# EAGLE design Pi0cket (EAGLE 7.7.0)
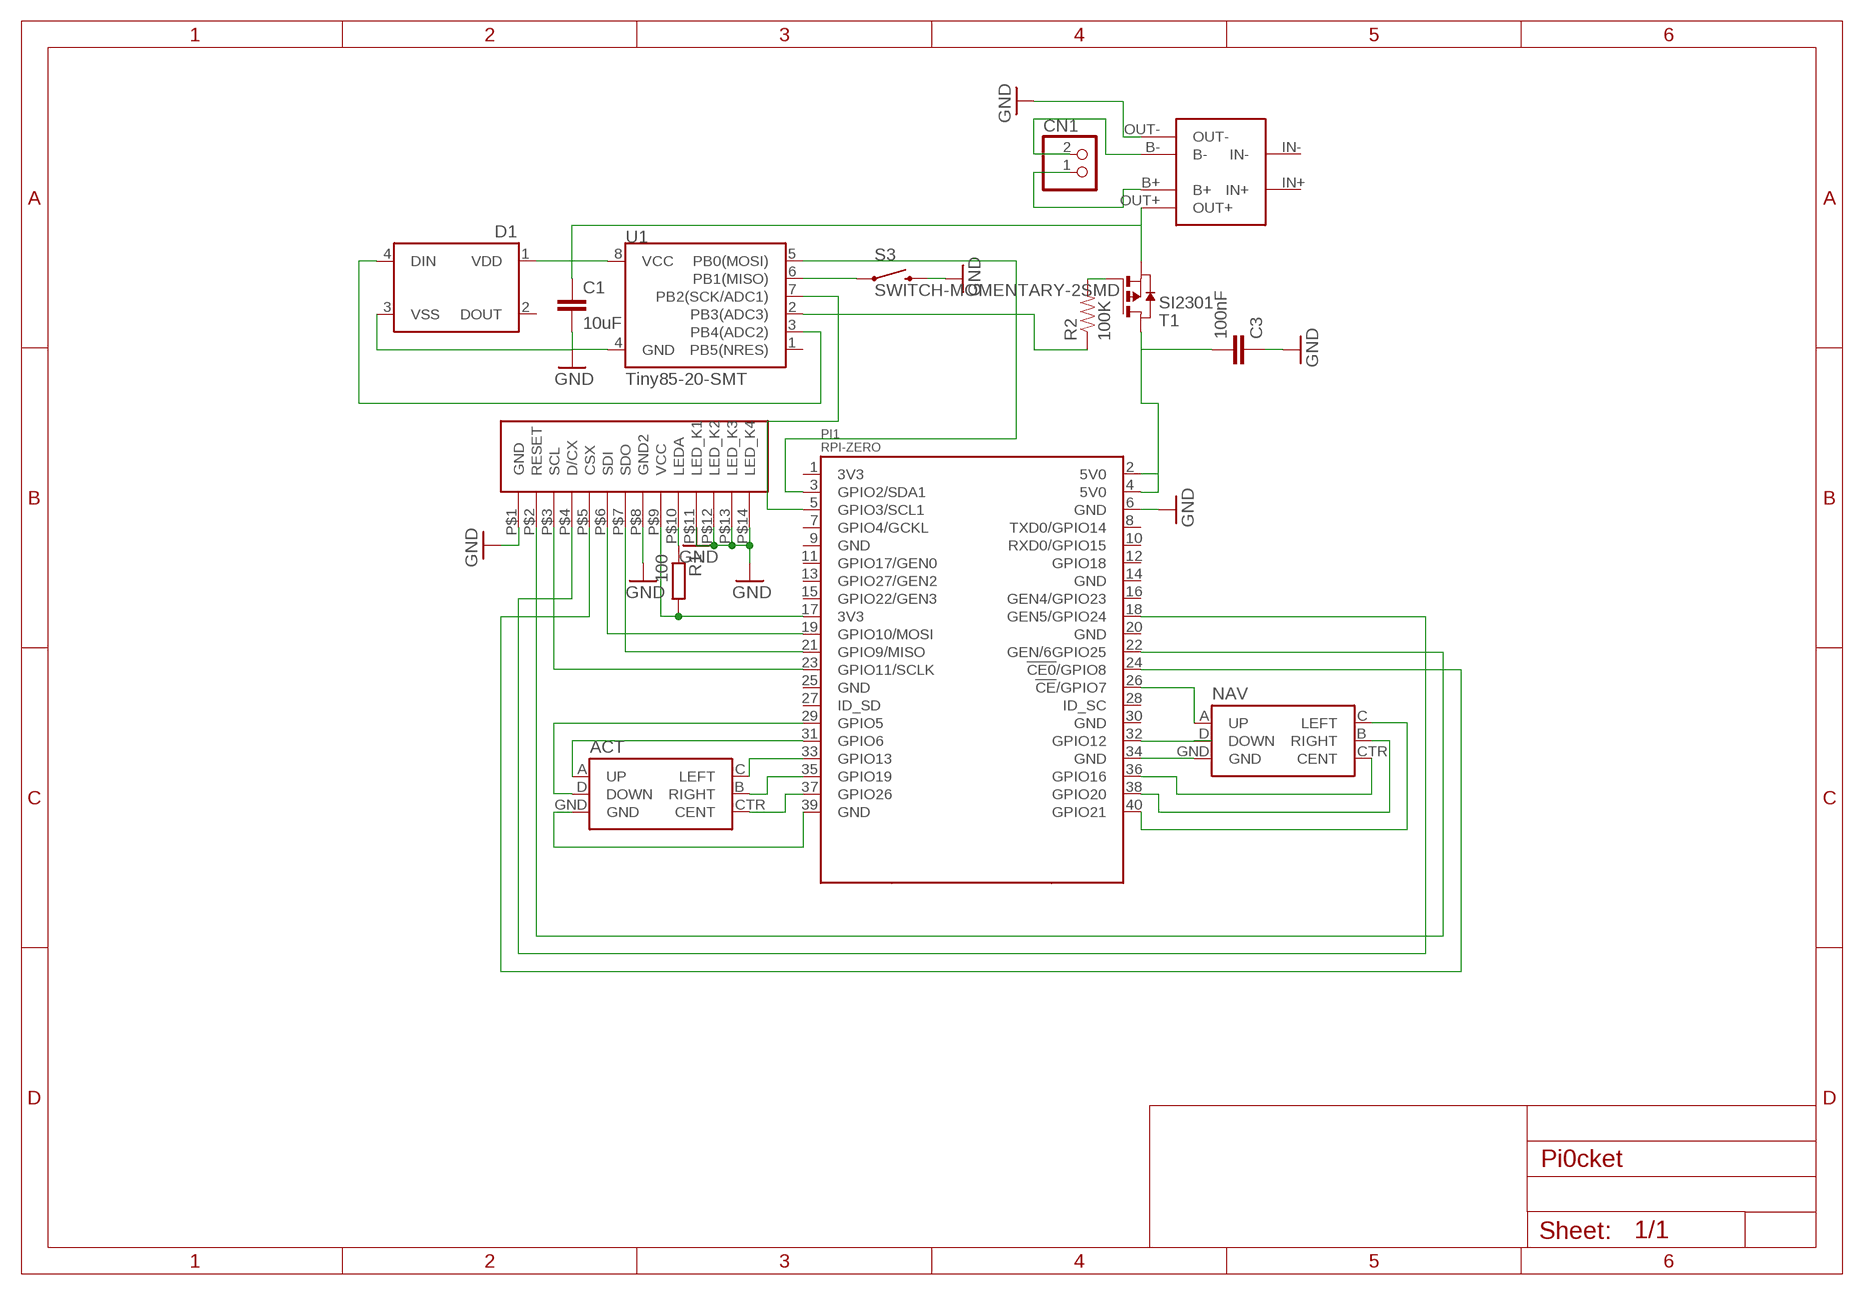
[diagram p0: schematic, sheet 1]

## Parts
ACT  JOYSTICK_MINI  [JOYSTICK_MINI]
C1  10uF  C-EUC0603K  [C0603K]
C3  100nF  C-EUC0603K  [C0603K]
CN1  JST_2PIN-SMT-RA  [JST-PH-2-SMT-RA]
D1  WS2812B  [WS2812B]
NAV  JOYSTICK_MINI  [JOYSTICK_MINI]
PI1  RPI-ZERO  [RASPBERRYPI_BASTELSTUBE_V13_RASPI_BOARD_B+_FULL]
POWER1  03962A  [03962A]
R1  100  R-EU_R0805  [R0805]
R2  100K  RESISTOR0603-RES  [0603-RES]
S3  SWITCH-MOMENTARY-2SMD  [TACTILE-SWITCH-SMD]
SCREEN1  ILI9341-2.2  [ILI9341-2.2]
T1  SI2301  PMOSSOT23  [SOT-23]
U1  Tiny85-20-SMT  ATTINY45TINY85-20-SMT  [SO08-EIAJ]

## Nets
5V0@2: C3.2 PI1.2(5V0) PI1.4(5V0) T1.1(D)
GND: C1.2 C3.1 D1.3(VSS) PI1.6(GND) POWER1.OUT- S3.3 SCREEN1.P$1(GND) SCREEN1.P$8(GND2) SCREEN1.P$11(LED_K1) SCREEN1.P$12(LED_K2) SCREEN1.P$13(LED_K3) SCREEN1.P$14(LED_K4) U1.4(GND)
GND@3: ACT.GND PI1.39(GND)
GND@7: NAV.GND PI1.34(GND)
N$1: PI1.22(GEN/6GPIO25) SCREEN1.P$2(RESET)
N$2: PI1.23(GPIO11/SCLK) SCREEN1.P$3(SCL)
N$3: PI1.19(GPIO10/MOSI) SCREEN1.P$6(SDI)
N$4: PI1.21(GPIO9/MISO) SCREEN1.P$7(SDO)
N$5: R1.1 SCREEN1.P$10(LEDA)
N$6: PI1.18(GEN5/GPIO24) SCREEN1.P$4(D/CX)
N$7: PI1.24(!CE0!/GPIO8) SCREEN1.P$5(CSX)
N$8: NAV.CTR(CENT) PI1.36(GPIO16)
N$9: ACT.CTR(CENT) PI1.37(GPIO26)
N$10: ACT.B(RIGHT) PI1.35(GPIO19)
N$11: ACT.C(LEFT) PI1.33(GPIO13)
N$12: ACT.A(UP) PI1.31(GPIO6)
N$13: ACT.D(DOWN) PI1.29(GPIO5)
N$14: NAV.B(RIGHT) PI1.38(GPIO20)
N$15: NAV.C(LEFT) PI1.40(GPIO21)
N$16: S3.1 U1.6(PB1(MISO))
N$17: NAV.D(DOWN) PI1.32(GPIO12)
N$18: NAV.A(UP) PI1.26(!CE!/GPIO7)
N$19: PI1.17(3V3) R1.2 SCREEN1.P$9(VCC)
N$20: R2.1 U1.2(PB3(ADC3))
N$21: R2.2 T1.3(G)
N$24: CN1.1 POWER1.B+
N$25: PI1.3(GPIO2/SDA1) U1.5(PB0(MOSI))
N$26: D1.4(DIN) U1.3(PB4(ADC2))
N$27: C1.1 D1.1(VDD) POWER1.OUT+ T1.2(S) U1.8(VCC)
N$28: PI1.5(GPIO3/SCL1) U1.7(PB2(SCK/ADC1))
N$29: CN1.2 POWER1.B-
Unconnected: D1.2(DOUT) PI1.1(3V3) PI1.7(GPIO4/GCKL) PI1.8(TXD0/GPIO14) PI1.9(GND) PI1.10(RXD0/GPIO15) PI1.11(GPIO17/GEN0) PI1.12(GPIO18) PI1.13(GPIO27/GEN2) PI1.14(GND) PI1.15(GPIO22/GEN3) PI1.16(GEN4/GPIO23) PI1.20(GND) PI1.25(GND) PI1.27(ID_SD) PI1.28(ID_SC) PI1.30(GND) POWER1.IN+ POWER1.IN- U1.1(PB5(NRES))

## Library data of the parts
ACT NAV = SparkFun-Electromechanical:JOYSTICK_MINI: Small 5-way tactile joystick, COM-10063 4UCON SF303GJ26; PROD_ID: SWCH-09905
C1 = resistor:C-EU: CAPACITOR, European symbol
C3 = rcl:C-EU: CAPACITOR, European symbol
CN1 = adafruit:JST_2PIN: JST 2-Pin Connectors of various flavors SMT-RA (S2B-PH-SM4) 4UConnector #17311 SMT (B2B-PH-SM4) THM-RA (S2B-PH) THM (B2B-PH)
D1 = SparkFun-LED:WS2812B: WS2812B - Intelligent control LED integrated light source Technical Specifications: Power Supply Voltage (VDD): 3.5 to 5.3 V Input Voltage (VI): -0.5 to VDD+0.5 V Operating Junction Temperature (Topt): -25°C to +80°C Storage Temperature Range (Tstg): -55°C to +150°C; PROD_ID: DIO-12503
PI1 = RPI-Zero:RPI-ZERO
POWER1 = 03962A:03962A
R1 = resistor:R-EU_: RESISTOR, European symbol
R2 = SparkFun-Passives:RESISTOR: Resistor Basic schematic elements and footprints for 0603, 1206, and PTH resistors.
S3 = SparkFun-Electromechanical:SWITCH-MOMENTARY-2: Various NO switches- pushbuttons, reed, etc; PROD_ID: SWCH-08247
SCREEN1 = ili9341:ILI9341-2.2
T1 = zetex:PMOSSOT23: MOS FET; OC_FARNELL: unknown; OC_NEWARK: unknown
U1 = SparkFun-DigitalIC:ATTINY45: Atmel 8-pin 2/4/8kB flash uC; PROD_ID: IC-09092

## Net classes
1 Power: width 0.406 mm, drill 0.356 mm, clearance 0.305 mm

## Board
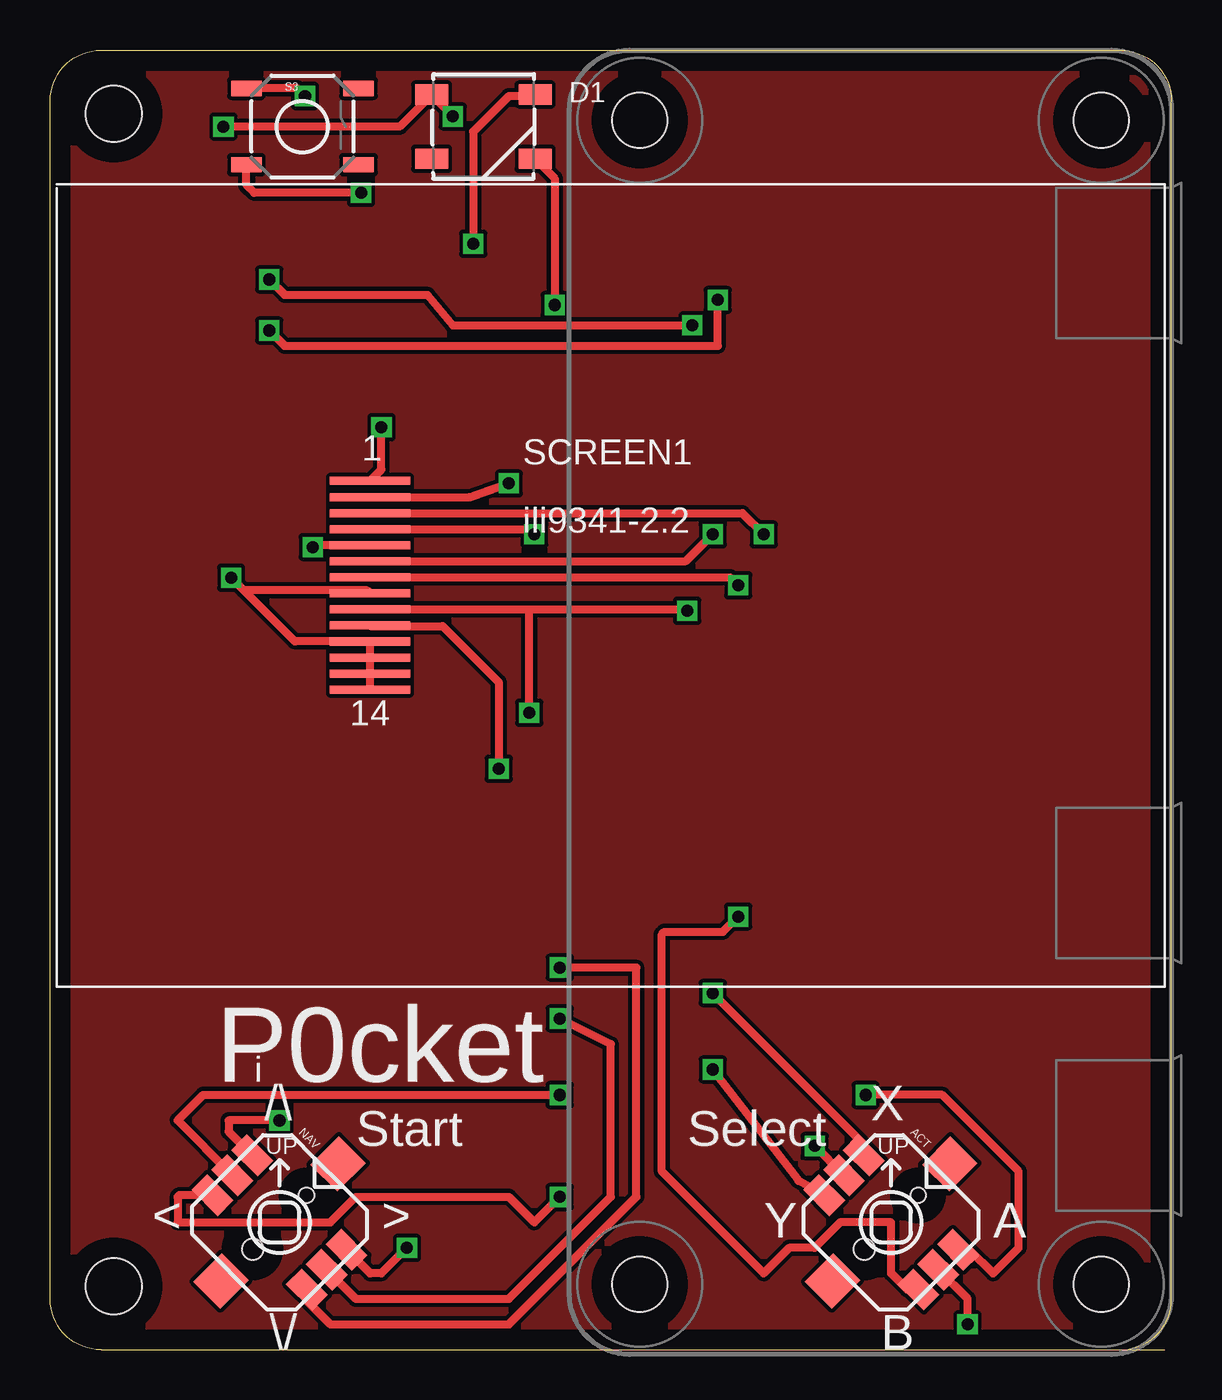
[diagram p1: board, top side]
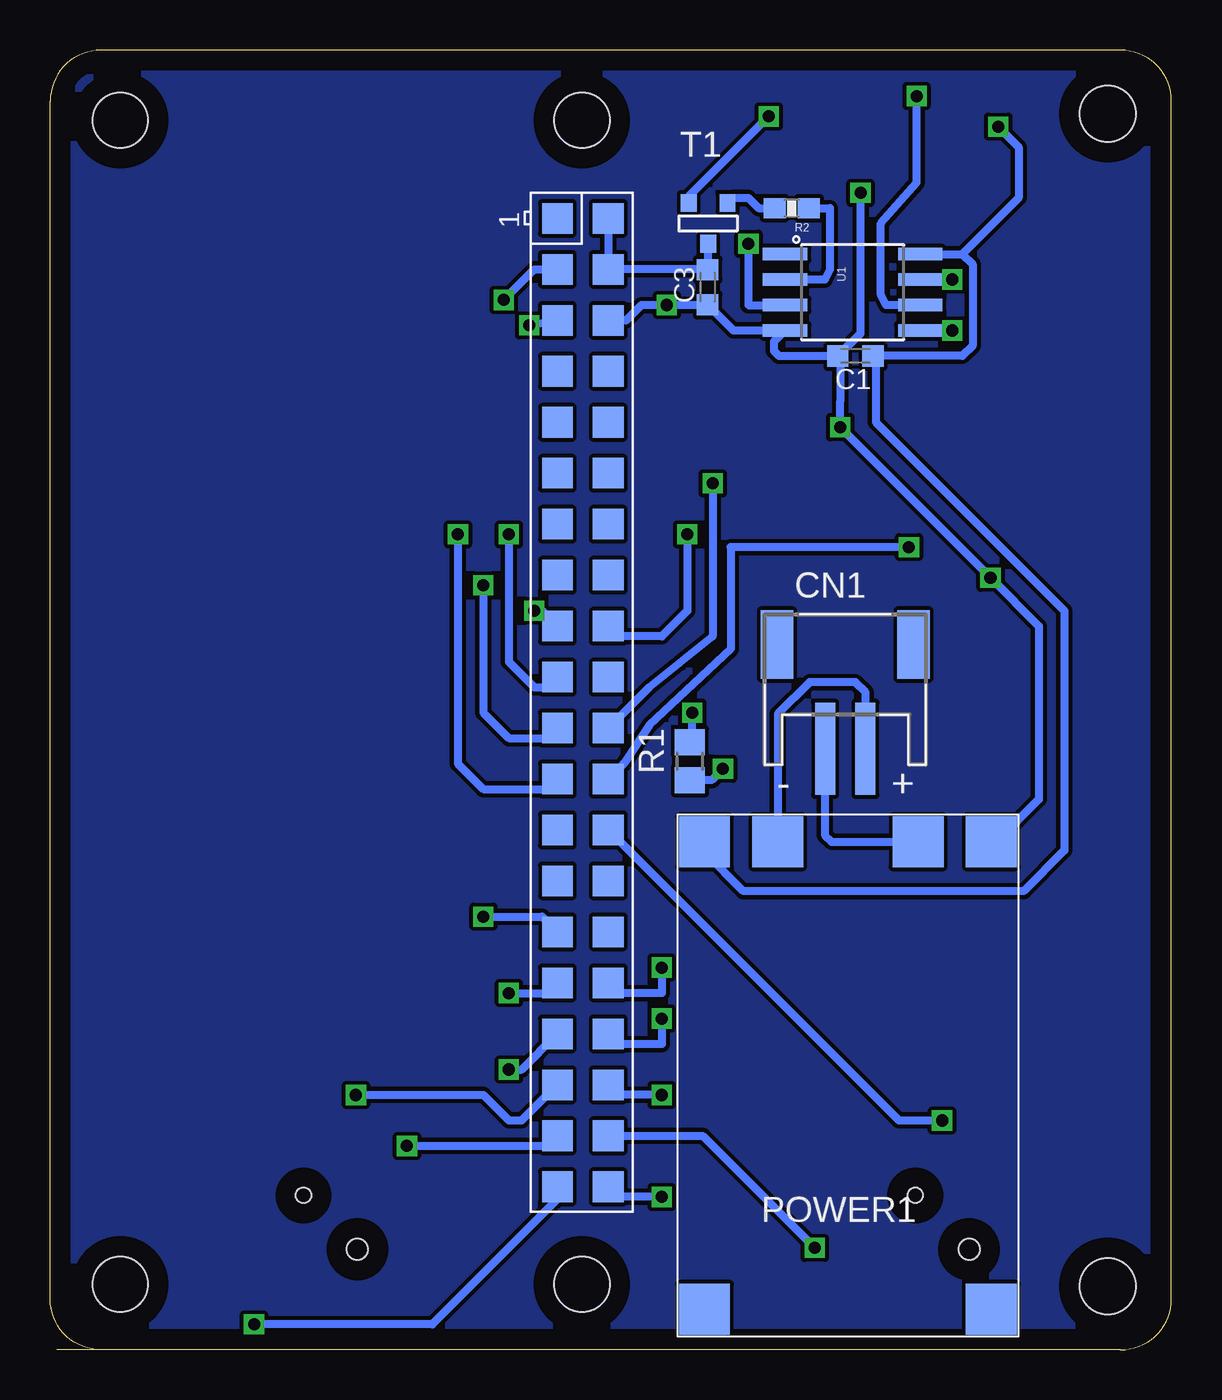
[diagram p2: board, bottom side, seen from below]

Size 55.88 x 64.77 mm. Coordinates in mm from the lower left corner, seen from the top.
Outline: 53.34,0 2.54,0 arc-90 0,2.54 0,62.23 arc-90 2.54,64.77 53.34,64.77 arc-90 55.88,62.23 55.88,2.54 arc-90 53.34,0
Outline: 53.34,0 55.55,0
Copper layers (1*16): Top 0.035mm / dielectric 1.5mm / Bottom 0.035mm
Design rules "default": minimum track width 10mil, minimum drill 24mil, track to track 8mil, track to pad 8mil, pad to pad 8mil, via to via 8mil, smd to smd 8mil, copper to edge 40mil, drill to drill 8mil, minimum pad ring 10mil, minimum via ring 8mil, stop-mask expansion 4mil, vias tented up to drill 0mil, thermal gap 10mil
Holes 2.8 mm at 3.18,61.59 3.18,3.18

### Footprints (pad centres in the part's own frame; a part is rotated, then mirrored left to right if it is on the bottom)
JOYSTICK_MINI = smd 1.85 x 1.1: A -3.325,1.4; B 3.325,1.4; C -3.325,-1.4; CTR -3.325,0; D 3.325,-1.4; GND 3.325,0 | smd 1.9 x 2: NC 0,4.13; NC@0 0,-4.13 | hole 0.75: 0,1.9 | hole 1.05: 0,-1.9
C0603K = smd 1.05 x 1.08: 1 -0.875,0; 2 0.875,0
JST-PH-2-SMT-RA = smd 1 x 4.6: 1 1,-3.7; 2 -1,-3.7 | smd 1.6 x 3.4: NC1 -3.4,1.5; NC2 3.4,1.5
WS2812B = smd 1.651 x 1: 1 -2.577,1.6; 2 -2.577,-1.6; 3 2.577,-1.6; 4 2.577,1.6
RASPBERRYPI_BASTELSTUBE_V13_RASPI_BOARD_B+_FULL = smd 1.524 x 1.524: 1 8.382,25.273; 2 8.382,27.813; 3 10.922,25.273; 4 10.922,27.813; 5 13.462,25.273; 6 13.462,27.813; 7 16.002,25.273; 8 16.002,27.813; 9 18.542,25.273; 10 18.542,27.813; 11 21.082,25.273; 12 21.082,27.813; 13 23.622,25.273; 14 23.622,27.813; 15 26.162,25.273; 16 26.162,27.813; 17 28.702,25.273; 18 28.702,27.813; 19 31.242,25.273; 20 31.242,27.813; 21 33.782,25.273; 22 33.782,27.813; 23 36.322,25.273; 24 36.322,27.813; 25 38.862,25.273; 26 38.862,27.813; 27 41.402,25.273; 28 41.402,27.813; 29 43.942,25.273; 30 43.942,27.813; 31 46.482,25.273; 32 46.482,27.813; 33 49.022,25.273; 34 49.022,27.813; 35 51.562,25.273; 36 51.562,27.813; 37 54.102,25.273; 38 54.102,27.813; 39 56.642,25.273; 40 56.642,27.813 | hole 2.75: 3.5,3.5; 3.5,26.5; 61.5,3.5; 61.5,26.5
03962A = smd 2.54 x 2.54: B+ 12,1.35; B- 5,1.35; IN+ 15.65,24.65; IN- 1.35,24.65; OUT+ 15.65,1.35; OUT- 1.35,1.35
R0805 = smd 1.3 x 1.5: 1 -0.95,0; 2 0.95,0
0603-RES = smd 1.1 x 1: 1 -0.85,0; 2 0.85,0
TACTILE-SWITCH-SMD = smd 1.524 x 0.762: 1 -2.794,1.905; 2 2.794,1.905; 3 -2.794,-1.905; 4 2.794,-1.905
ILI9341-2.2 = smd 4 x 0.4: P$1 -12,5.2; P$2 -12,4.4; P$3 -12,3.6; P$4 -12,2.8; P$5 -12,2; P$6 -12,1.2; P$7 -12,0.4; P$8 -12,-0.4; P$9 -12,-1.2; P$10 -12,-2; P$11 -12,-2.8; P$12 -12,-3.6; P$13 -12,-4.4; P$14 -12,-5.2
SOT-23 = smd 0.787 x 0.889: 1 0.025,-1.016; 2 -0.94,1.016; 3 0.991,1.016
SO08-EIAJ = smd 0.61 x 2.21: 1 -1.905,-3.378; 2 -0.635,-3.378; 3 0.635,-3.378; 4 1.905,-3.378; 5 1.905,3.353; 6 0.635,3.353; 7 -0.635,3.353; 8 -1.905,3.353

### Placement (x,y rotation side)
ACT  41.91,6.35 315 top
C1  15.75,49.53 180 bottom
C3  23.11,52.96 90 bottom
CN1  16.26,33.65 0 bottom
D1  21.59,60.96 0 top
NAV  11.43,6.35 315 top
PI1  55.88,64.77 270 bottom
POWER1  7.62,26.67 180 bottom
R1  24,29.34 90 bottom
R2  18.92,56.9 180 bottom
S3  12.57,60.96 0 top
SCREEN1  27.94,38.1 0 top
T1  23.11,56.13 0 bottom
U1  15.88,52.7 270 bottom

### Tracks (layer width: path | path; a pad name or v marks a point on that pad's centre or on a via)
5V0@2
  Bottom 0.406: PI1.2 PI1.4 23.13,53.85 C3.2 23.11,55.09 T1.1
GND  (via drill 0.6)
  Top 0.406: SCREEN1.P$14 SCREEN1.P$13 SCREEN1.P$12 SCREEN1.P$11 12.19,35.31 9.65,37.85 | v15.49,57.66 10.16,57.66 9.78,58.04 S3.3 | 9.65,37.85 v9.02,38.48 | SCREEN1.P$8 15.79,37.85 9.65,37.85 | D1.3 25.15,58.38 v25.15,52.07 | SCREEN1.P$1 16.51,43.87 v16.51,45.97
  Bottom 0.406: C3.1 21.83,50.8 U1.4 19.81,50.24 19.81,49.78 19.56,49.53 C1.2 | C1.2 15.49,50.66 v15.49,57.66 | C1.2 16.51,49.42 16.51,47.24 v16.51,45.97 v9.02,38.48 6.6,36.07 6.6,27.43 8.72,25.32 POWER1.OUT- | C3.1 23.13,52.07 v25.15,52.07 | v25.15,52.07 26.42,52.07 27.18,51.31 PI1.6 | v25.15,52.07 25.13,52.08 C3.1
GND@3  (via drill 0.6)
  Top 0.406: v45.72,1.27 45.72,2.54 ACT.GND
  Bottom 0.406: PI1.39 30.61,7.49 36.83,1.27 v45.72,1.27
GND@7  (via drill 0.6)
  Top 0.406: NAV.GND | NAV.GND 15.24,2.54 22.86,2.54 27.94,7.62 27.94,15.24 v25.4,16.51
  Bottom 0.406: v25.4,16.51 25.4,15.24 27.56,15.24 PI1.34
N$1  (via drill 0.6)
  Top 0.406: SCREEN1.P$2 20.91,42.5 v22.86,43.18
  Bottom 0.406: v22.86,43.18 22.86,35.56 26.04,33.02 PI1.22
N$2  (via drill 0.6)
  Top 0.406: SCREEN1.P$3 34.5,41.7 v35.56,40.64
  Bottom 0.406: v35.56,40.64 35.56,29.21 34.29,27.94 31.11,27.94 PI1.23
N$3  (via drill 0.6)
  Top 0.406: SCREEN1.P$6 31.68,39.3 v33.02,40.64
  Bottom 0.406: v33.02,40.64 33.02,34.29 31.75,33.02 31.11,33.02 PI1.19
N$4  (via drill 0.6)
  Top 0.406: SCREEN1.P$7 33.89,38.5 v34.29,38.1
  Bottom 0.406: v34.29,38.1 34.29,31.75 33.02,30.48 31.11,30.48 PI1.21
N$5  (via drill 0.6)
  Top 0.406: SCREEN1.P$10 15.97,36.07 19.56,36.07 22.35,33.27 v22.35,28.96
  Bottom 0.406: v22.35,28.96 22.92,28.39 R1.1
N$6  (via drill 0.6)
  Top 0.406: SCREEN1.P$4 23.87,40.9 v24.13,40.64
  Bottom 0.406: v24.13,40.64 24.13,36.83 25.4,35.56 27.56,35.56 PI1.18
N$7  (via drill 0.6)
  Top 0.406: SCREEN1.P$5 13.43,40.1 v13.08,40
  Bottom 0.406: v13.08,40 21.97,40 21.97,34.92 26.04,31.11 27.3,29.21 PI1.24
N$8  (via drill 0.6)
  Top 0.406: NAV.CTR | NAV.CTR 6.35,11.43 7.62,12.7 v25.4,12.7
  Bottom 0.406: v25.4,12.7 27.56,12.7 PI1.36
N$9  (via drill 0.6)
  Top 0.406: ACT.CTR | ACT.CTR v38.1,10.16
  Bottom 0.406: v38.1,10.16 31.11,10.16 PI1.37
N$10  (via drill 0.6)
  Top 0.406: ACT.B 45.81,4.99 46.99,3.81 48.26,5.08 48.26,8.89 44.45,12.7 v40.64,12.7
  Bottom 0.406: v40.64,12.7 34.29,12.7 33.02,11.43 32.38,11.43 PI1.35
N$11  (via drill 0.6)
  Top 0.406: ACT.C 37.3,8.42 v33.02,13.97
  Bottom 0.406: v33.02,13.97 32.38,13.97 PI1.33
N$12  (via drill 0.6)
  Top 0.406: ACT.A 40.55,10.25 v33.02,17.78
  Bottom 0.406: v33.02,17.78 31.11,17.78 PI1.31
N$13  (via drill 0.6)
  Top 0.406: ACT.D 42.71,3.01 41.91,3.81 41.91,6.35 39.37,6.35 38.1,5.08 36.83,5.08 35.56,3.81 30.48,8.89 30.48,20.7 PI1.29 33.53,20.83 v34.29,21.59
  Bottom 0.406: v34.29,21.59 31.37,21.59 PI1.29
N$14  (via drill 0.6)
  Top 0.406: v17.78,5.08 16.51,3.81 15.95,3.81 NAV.B
  Bottom 0.406: PI1.38 23.37,10.67 v17.78,5.08
N$15  (via drill 0.6)
  Top 0.406: NAV.C 6.44,7.71 6.35,7.62 6.35,6.35 13.97,6.35 15.24,7.62 22.86,7.62 24.13,6.35 v25.4,7.62
  Bottom 0.406: v25.4,7.62 27.56,7.62 PI1.40
N$16  (via drill 0.6)
  Top 0.406: v12.7,62.48 12.32,62.87 S3.1
  Bottom 0.406: U1.6 14.22,52.07 14.48,52.58 14.48,56.13 12.7,58.17 v12.7,62.48
N$17  (via drill 0.6)
  Top 0.406: NAV.D 12.79,2.45 13.97,1.27 22.86,1.27 29.21,7.62 29.21,19.05 v25.4,19.05
  Bottom 0.406: v25.4,19.05 25.4,17.78 27.56,17.78 PI1.32
N$18  (via drill 0.6)
  Top 0.406: v11.43,11.43 8.89,11.43 8.89,10.87 NAV.A
  Bottom 0.406: PI1.26 13.59,11.43 v11.43,11.43
N$19  (via drill 0.6)
  Top 0.406: SCREEN1.P$9 23.88,36.9 | 23.88,36.9 31.68,36.9 v31.75,36.83 | v23.88,31.75 23.88,36.9
  Bottom 0.406: v31.75,36.83 31.37,36.83 PI1.17 | R1.2 23.88,30.41 v23.88,31.75
N$20
  Bottom 0.406: R2.1 17.02,56.9 17.02,53.85 17.27,53.34 U1.2
N$21
  Bottom 0.406: T1.3 21.87,57.4 21.08,57.4 20.57,56.9 R2.2
N$22
  pour Top: 0,64.77 55.88,64.77 55.88,0 0,0
N$23
  pour Bottom: 0,64.77 55.88,64.77 55.88,0 0,0
N$24
  Bottom 0.406: CN1.1 15.24,29.97 15.24,32.77 15.75,33.27 18.03,33.27 19.62,31.69 POWER1.B+
N$25  (via drill 0.6)
  Top 0.406: v10.92,50.8 11.68,50.04 33.27,50.04 v33.27,52.32
  Bottom 0.406: U1.5 v10.92,50.8 | v33.27,52.32 31.75,53.85 PI1.3
N$26  (via drill 0.6)
  Top 0.406: D1.4 24.09,62.48 22.86,62.48 21.08,60.71 v21.08,55.12
  Bottom 0.406: v21.08,55.12 21.08,52.07 U1.3
N$27  (via drill 0.6)
  Top 0.406: v8.64,60.96 17.41,60.96 D1.1 20.07,61.51 v20.07,61.47
  Bottom 0.406: v8.64,60.96 7.62,59.94 7.62,57.4 10.41,54.61 | U1.8 10.41,54.61 | 10.41,54.61 9.91,54.1 9.91,50.04 10.41,49.53 C1.1 14.73,49.39 14.73,46.23 5.33,36.83 5.33,24.89 7.37,22.86 21.34,22.86 23.27,24.79 POWER1.OUT+ | v20.07,61.47 24.05,57.48 T1.2
N$28  (via drill 0.6)
  Top 0.406: v10.92,53.34 11.68,52.58 18.8,52.58 20.07,51.05 v32,51.05
  Bottom 0.406: U1.7 v10.92,53.34 | v32,51.05 PI1.5
N$29
  Bottom 0.406: CN1.2 17.27,29.94 17.27,25.65 16.94,25.32 POWER1.B-

### Text on the board
tNames: P0cket | i | /\\ | X | Start | Select | < | > | Y | A | \\/ | B